# Altium schematic sheet BusMaster Information.SchDoc
size A; SheetNumber: 1; SheetTotal: 2
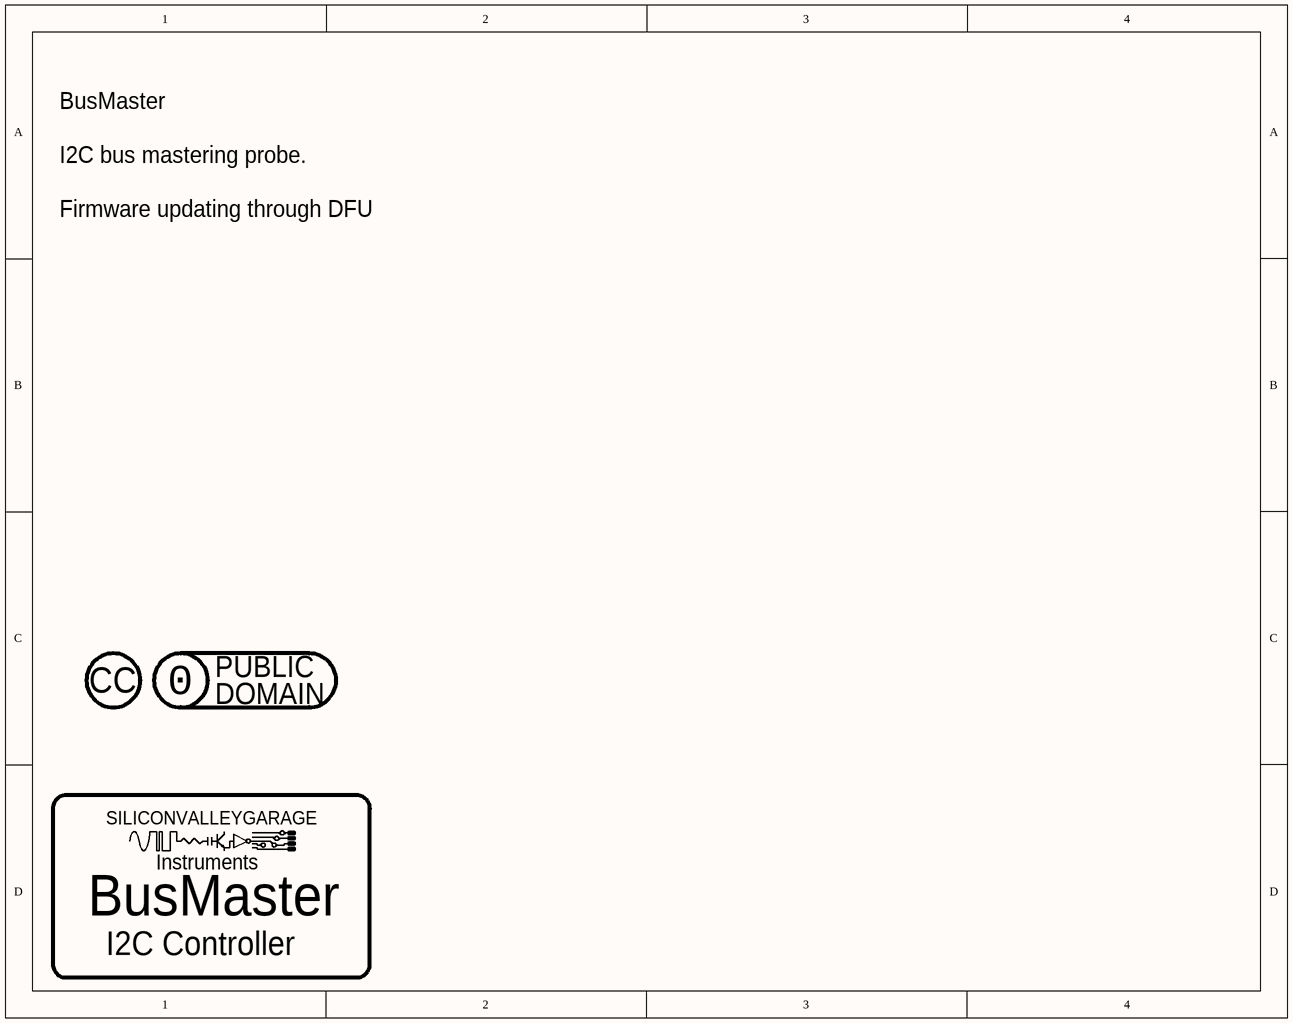
[diagram p0: BusMaster Information.SchDoc]

## Parts
LOGO5  LOGO-LICENSE-CC0-PUBLIC  [LOGO-LICENSE-CC0-PUBLIC]  (value not drawn)  (no BOM)
LOGO6  LOGO-LICENSE-CC  [LOGO-LICENSE-CC]  (value not drawn)  (no BOM)
LOGO?  LOGO-SILICONVALLEYGARAGE-SMALL  [SILICONVALLEYGARAGE]  (value not drawn)  (graphical)

## Blocks framed on the sheet
BusMaster: LOGO?

## Notes on the sheet
- BusMaster
  I2C bus mastering probe.
  Firmware updating through DFU
- (near LOGO?) Instruments
- I2C Controller
- (in symbol LOGO-LICENSE-CC) CC
- (in symbol LOGO-LICENSE-CC0-PUBLIC) PUBLIC; 0; DOMAIN
- (in symbol LOGO-SILICONVALLEYGARAGE-SMALL) SILICONVALLEYGARAGE

## Library data of the parts
LOGO? = LOGO-SILICONVALLEYGARAGE-SMALL: LOGO,SILICONVALLEYGARAGE,SMALL